# Altium project New_Action.PrjPcb
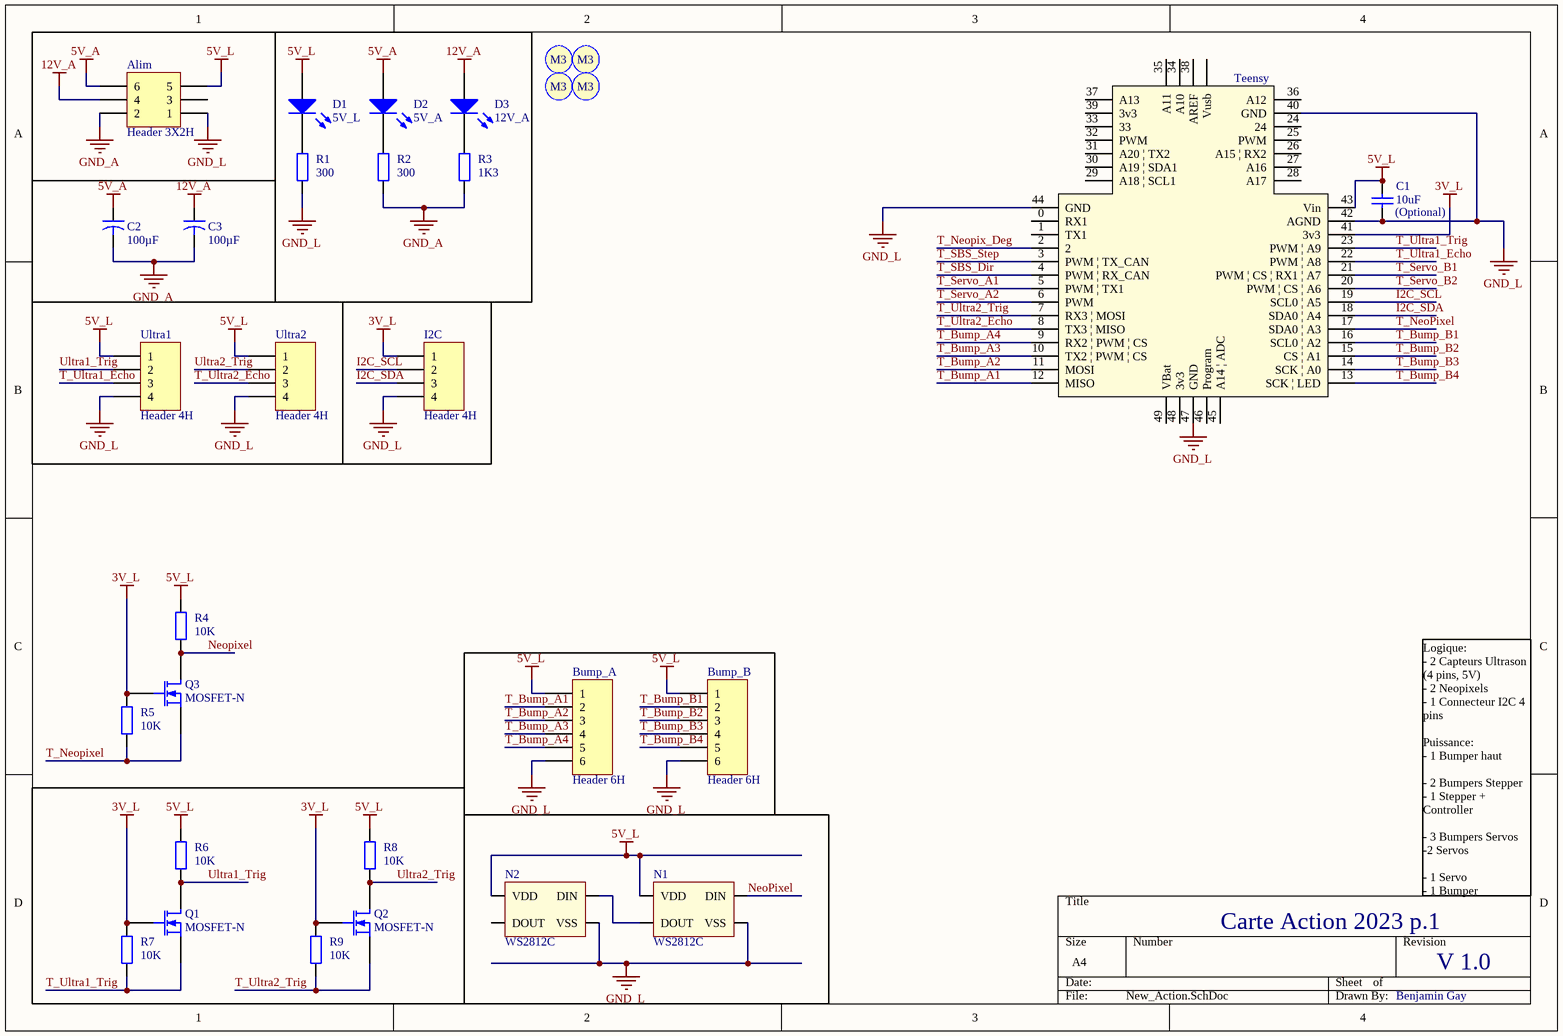
[diagram p0: New_Action.SchDoc]
2 sheets, 57 parts. Net scope: global (net labels, ports and power ports of the same name join across sheets).
Board file: New_Action.PcbDoc
Sheets:
  New_Action.SchDoc
  New_Action_Moteurs.SchDoc

## Sheet New_Action.SchDoc
size A4

### Parts
Alim  Header 3X2H  [MOLEX_MINIFITJR_3X2H]
Bump_A  Header 6H  [S6B-XH-A]
Bump_B  Header 6H  [S6B-XH-A]
C1  (Optional)  value 10uF  [Capacitor 1206]
C2  value 100µF  [Condensateur]  (hidden comment: Cap2)
C3  value 100µF  [Condensateur]  (hidden comment: Cap2)
D1  5V_L  [KP-3216SEC]
D2  5V_A  [KP-3216SEC]
D3  12V_A  [KP-3216SEC]
I2C  Header 4H  [S4B-XH-A]
N1  WS2812C  [WS2812C]
N2  WS2812C  [WS2812C]
Q1  MOSFET-N  [SOT23_M]
Q2  MOSFET-N  [SOT23_M]
Q3  MOSFET-N  [SOT23_M]
R1  value 300  [Resistor 1206]  (hidden comment: Res2)
R2  value 300  [Resistor 1206]  (hidden comment: Res2)
R3  value 1K3  [Resistor 1206]  (hidden comment: Res2)
R4  value 10K  [Resistor 1206]  (hidden comment: Res2)
R5  value 10K  [Resistor 1206]  (hidden comment: Res2)
R6  value 10K  [Resistor 1206]  (hidden comment: Res2)
R7  value 10K  [Resistor 1206]  (hidden comment: Res2)
R8  value 10K  [Resistor 1206]  (hidden comment: Res2)
R9  value 10K  [Resistor 1206]  (hidden comment: Res2)
S1  Screw M3  [Screw M3]  (value not drawn)
S2  Screw M3  [Screw M3]  (value not drawn)
S3  Screw M3  [Screw M3]  (value not drawn)
S4  Screw M3  [Screw M3]  (value not drawn)
Teensy  Teensy 3.2  [teensy]  (value not drawn)
Ultra1  Header 4H  [S4B-XH-A]
Ultra2  Header 4H  [S4B-XH-A]

### Nets
3V_L: I2C.1 Q1.2(G) Q2.2(G) Q3.2(G) R5.1 R7.1 R9.1 Teensy.41(3v3)
5V_A: Alim.6 C2.1 D2.1(A)
5V_L: Alim.5 Bump_A.1 Bump_B.1 C1.2 D1.1(A) N1.1(VDD) N2.1(VDD) R4.1 R6.1 R8.1 Teensy.43(Vin) Ultra1.1 Ultra2.1
12V_A: Alim.4 C3.1 D3.1(A)
GND_A: Alim.2 C2.2 C3.2 R2.2 R3.2
GND_L: Alim.1 Bump_A.6 Bump_B.6 C1.1 I2C.4 N1.3(VSS) N2.3(VSS) R1.1 Teensy.40(GND) Teensy.42(AGND) Teensy.44(GND) Teensy.47(GND) Ultra1.4 Ultra2.4
I2C_SCL: I2C.2 Teensy.19(SCL0_|_A5)
I2C_SDA: I2C.3 Teensy.18(SDA0_|_A4)
NeoPixel: N1.4(DIN) Q3.1(D) R4.2
T_Bump_A1: Bump_A.2 Teensy.12(MISO)
T_Bump_A2: Bump_A.3 Teensy.11(MOSI)
T_Bump_A3: Bump_A.4 Teensy.10(TX2_|_PWM_|_CS)
T_Bump_A4: Bump_A.5 Teensy.9(RX2_|_PWM_|_CS)
T_Bump_B1: Bump_B.2 Teensy.16(SCL0_|_A2)
T_Bump_B2: Bump_B.3 Teensy.15(CS_|_A1)
T_Bump_B3: Bump_B.4 Teensy.14(SCK_|_A0)
T_Bump_B4: Bump_B.5 Teensy.13(SCK_|_LED)
T_Neopix_Deg: Teensy.2
T_NeoPixel: Q3.3(S) R5.2 Teensy.17(SDA0_|_A3)
T_SBS_Dir: Teensy.4(PWM_|_RX_CAN)
T_SBS_Step: Teensy.3(PWM_|_TX_CAN)
T_Servo_A1: Teensy.5(PWM_|_TX1)
T_Servo_A2: Teensy.6(PWM)
T_Servo_B1: Teensy.21(PWM_|_CS_|_RX1_|_A7)
T_Servo_B2: Teensy.20(PWM_|_CS_|_A6)
T_Ultra1_Echo: Teensy.22(PWM_|_A8) Ultra1.3
T_Ultra1_Trig: Q1.3(S) R7.2 Teensy.23(PWM_|_A9)
T_Ultra2_Echo: Teensy.8(TX3_|_MISO) Ultra2.3
T_Ultra2_Trig: Q2.3(S) R9.2 Teensy.7(RX3_|_MOSI)
Ultra1_Trig: Q1.1(D) R6.2 Ultra1.2
Ultra2_Trig: Q2.1(D) R8.2 Ultra2.2
NetD1_2: D1.2(K) R1.2
NetD2_2: D2.2(K) R2.1
NetD3_2: D3.2(K) R3.1
NetN1_2: N1.2(DOUT) N2.4(DIN)

Not connected (* = marked no-connect by the designer): Alim 3; N2 2(DOUT); Teensy 0(RX1) 1(TX1) 24 25(PWM) 26(A15_|_RX2) 27(A16) 28(A17) 29(A18_|_SCL1) 30(A19_|_SDA1) 31(A20_|_TX2) 32(PWM) 33 34(A10) 35(A11) 36(A12) 37(A13) 38(AREF) 39(3v3) 45(A14_|_ADC) 46(Program) 48(3v3) 49(VBat) 50(Vusb)

### Notes on the sheet
- Logique:
  - 2 Capteurs Ultrason (4 pins, 5V)
  - 2 Neopixels
  - 1 Connecteur I2C 4 pins
  Puissance:
  - 1 Bumper haut
  - 2 Bumpers Stepper
  - 1 Stepper + Controller
  - 3 Bumpers Servos
  -2 Servos
  - 1 Servo
  - 1 Bumper
- Carte Action 2023 p.1
- V 1.0
- Benjamin Gay
- (in symbol Screw M3) M3

### Library data of the parts
Alim = Header 3X2H: Header, 3-Pin, Dual row, Right Angle; LatestRevisionDate: 17-Jul-2002; LatestRevisionNote: Re-released for DXP Platform.; Publisher: Altium Limited
Bump_A Bump_B = Header 6H: Header, 6-Pin, Right Angle; LatestRevisionDate: 17-Jul-2002; LatestRevisionNote: Re-released for DXP Platform.; Publisher: Altium Limited
C1 = Cap: Capacitor; Published: 8-Jun-2000; LatestRevisionDate: 17-Jul-2002; LatestRevisionNote: Re-released for DXP Platform.; PackageReference: RAD-0.3; Publisher: Altium Limited; PackageDescription: Radial Cap, Thru-Hole; 2 Leads; 0.3 in Pin Spacing
C2 C3 = Cap2: Capacitor; Published: 23-Sep-2002; PackageReference: CAPR5-4X5; Publisher: Altium Limited; PackageDescription: Capacitor; 2 Leads
D1-D3 = LED2: Typical RED, GREEN, YELLOW, AMBER GaAs LED; Published: 8-Jun-2000; LatestRevisionDate: 17-Jul-2002; LatestRevisionNote: Re-released for DXP Platform.; PackageVersion: Feb-2002; PackageReference: 3.2X1.6X1.1; Publisher: Altium Limited; PackageDescription: SM LED; 2 Flat Leads
I2C Ultra1 Ultra2 = Header 4H: Header, 4-Pin, Right Angle; LatestRevisionDate: 17-Jul-2002; LatestRevisionNote: Re-released for DXP Platform.; Publisher: Altium Limited
N1 N2 = WS2812C: Intelligent control LED
Q1-Q3 = MOSFET-N: N-Channel MOSFET; pin to pad: 2>3 3>2; Published: 8-Jun-2000; LatestRevisionDate: 17-Jul-2002; LatestRevisionNote: Re-released for DXP Platform.; PackageVersion: 1995/1996; PackageReference: E3; Publisher: Altium Limited; PackageDescription: TO, Flat Index; 3 In-Line, Axial Leads; Body Dia. 4.6mm; Lead Dia. 0.5 mm (max)
R1-R9 = Res2: Resistor; Published: 8-Jun-2000; LatestRevisionDate: 17-Jul-2002; LatestRevisionNote: Re-released for DXP Platform.; PackageReference: AXIAL-0.4; Publisher: Altium Limited; PackageDescription: Axial Device, Thru-Hole; 2 Leads; 0.4 in Pin Spacing
Teensy = teensy3.2

## Sheet New_Action_Moteurs.SchDoc
size A4
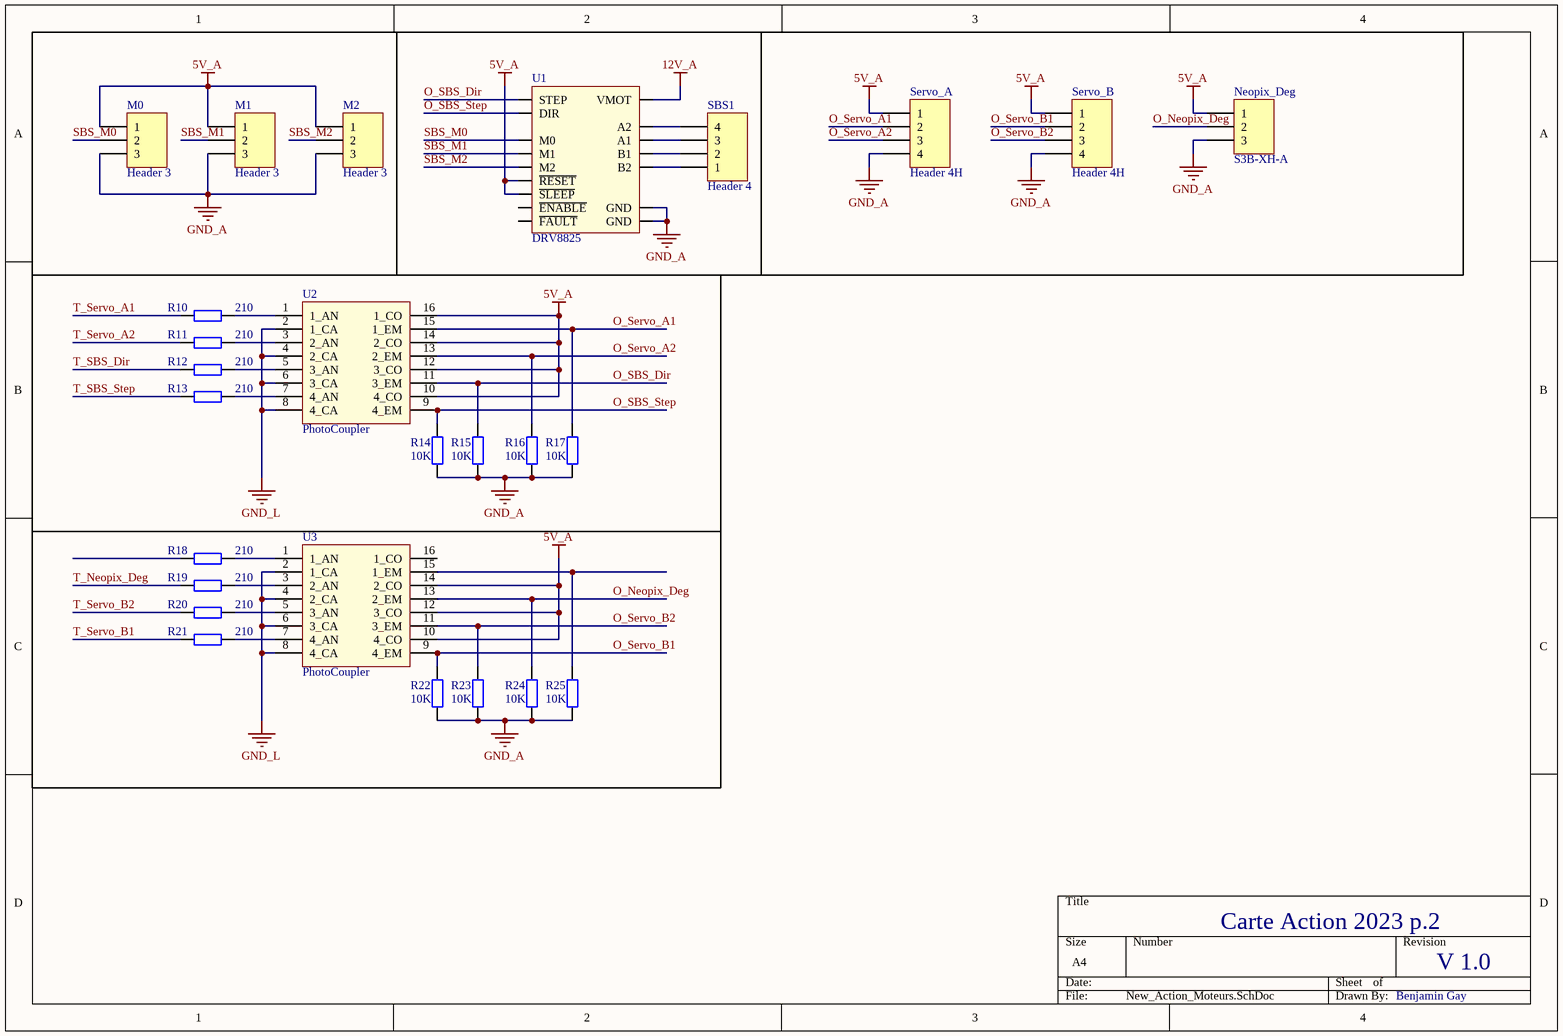
[diagram p1: New_Action_Moteurs.SchDoc]

### Parts
M0  Header 3  [HDR1X3]
M1  Header 3  [HDR1X3]
M2  Header 3  [HDR1X3]
Neopix_Deg  S3B-XH-A  [S3B-XH-A]
R10  value 210  [Resistor 1206]  (hidden comment: Res2)
R11  value 210  [Resistor 1206]  (hidden comment: Res2)
R12  value 210  [Resistor 1206]  (hidden comment: Res2)
R13  value 210  [Resistor 1206]  (hidden comment: Res2)
R14  value 10K  [Resistor 1206]  (hidden comment: Res2)
R15  value 10K  [Resistor 1206]  (hidden comment: Res2)
R16  value 10K  [Resistor 1206]  (hidden comment: Res2)
R17  value 10K  [Resistor 1206]  (hidden comment: Res2)
R18  value 210  [Resistor 1206]  (hidden comment: Res2)
R19  value 210  [Resistor 1206]  (hidden comment: Res2)
R20  value 210  [Resistor 1206]  (hidden comment: Res2)
R21  value 210  [Resistor 1206]  (hidden comment: Res2)
R22  value 10K  [Resistor 1206]  (hidden comment: Res2)
R23  value 10K  [Resistor 1206]  (hidden comment: Res2)
R24  value 10K  [Resistor 1206]  (hidden comment: Res2)
R25  value 10K  [Resistor 1206]  (hidden comment: Res2)
SBS1  Header 4  [S4B-XH-A]
Servo_A  Header 4H  [S4B-XH-A]
Servo_B  Header 4H  [S4B-XH-A]
U1  DRV8825  [DRV8825]
U2  PhotoCoupler  [16 pins SOIC, TI]
U3  PhotoCoupler  [16 pins SOIC, TI]

### Nets
5V_A: M0.1 M1.1 M2.1 Neopix_Deg.1 Servo_A.1 Servo_B.1 U1.5(~{RESET}) U1.6(~{SLEEP}) U2.10(4_CO) U2.12(3_CO) U2.14(2_CO) U2.16(1_CO) U3.10(4_CO) U3.12(3_CO) U3.14(2_CO)
12V_A: U1.16(VMOT)
GND_A: M0.3 M1.3 M2.3 Neopix_Deg.3 R14.1 R15.1 R16.1 R17.1 R22.1 R23.1 R24.1 R25.1 Servo_A.4 Servo_B.4 U1.9(GND) U1.15(GND)
GND_L: U2.2(1_CA) U2.4(2_CA) U2.6(3_CA) U2.8(4_CA) U3.2(1_CA) U3.4(2_CA) U3.6(3_CA) U3.8(4_CA)
O_Neopix_Deg: Neopix_Deg.2 R24.2 U3.13(2_EM)
O_SBS_Dir: R15.2 U1.7(STEP) U2.11(3_EM)
O_SBS_Step: R14.2 U1.8(DIR) U2.9(4_EM)
O_Servo_A1: R17.2 Servo_A.2 U2.15(1_EM)
O_Servo_A2: R16.2 Servo_A.3 U2.13(2_EM)
O_Servo_B1: R22.2 Servo_B.2 U3.9(4_EM)
O_Servo_B2: R23.2 Servo_B.3 U3.11(3_EM)
SBS_M0: M0.2 U1.2(M0)
SBS_M1: M1.2 U1.3(M1)
SBS_M2: M2.2 U1.4(M2)
T_Neopix_Deg: R19.2
T_SBS_Dir: R12.2
T_SBS_Step: R13.2
T_Servo_A1: R10.2
T_Servo_A2: R11.2
T_Servo_B1: R21.2
T_Servo_B2: R20.2
NetR10_1: R10.1 U2.1(1_AN)
NetR11_1: R11.1 U2.3(2_AN)
NetR12_1: R12.1 U2.5(3_AN)
NetR13_1: R13.1 U2.7(4_AN)
NetR18_1: R18.1 U3.1(1_AN)
NetR19_1: R19.1 U3.3(2_AN)
NetR20_1: R20.1 U3.5(3_AN)
NetR21_1: R21.1 U3.7(4_AN)
NetR25_2: R25.2 U3.15(1_EM)
NetSBS1_1: SBS1.1 U1.14(B2)
NetSBS1_2: SBS1.2 U1.13(B1)
NetSBS1_3: SBS1.3 U1.12(A1)
NetSBS1_4: SBS1.4 U1.11(A2)

Not connected (* = marked no-connect by the designer): R18 2; U1 1(~{ENABLE}) 10(~{FAULT}); U3 16(1_CO)

### Notes on the sheet
- Carte Action 2023 p.2
- V 1.0
- Benjamin Gay

### Library data of the parts
M0-M2 = Header 3: Header, 3-Pin; LatestRevisionDate: 17-Jul-2002; LatestRevisionNote: Re-released for DXP Platform.; Publisher: Altium Limited
Neopix_Deg = Header 3H: Header, 3-Pin, Right Angle; LatestRevisionDate: 17-Jul-2002; LatestRevisionNote: Re-released for DXP Platform.; Publisher: Altium Limited
R10-R25 = Res2: Resistor; Published: 8-Jun-2000; LatestRevisionDate: 17-Jul-2002; LatestRevisionNote: Re-released for DXP Platform.; PackageReference: AXIAL-0.4; Publisher: Altium Limited; PackageDescription: Axial Device, Thru-Hole; 2 Leads; 0.4 in Pin Spacing
SBS1 = Header 4: Header, 4-Pin; LatestRevisionDate: 17-Jul-2002; LatestRevisionNote: Re-released for DXP Platform.; Publisher: Altium Limited
Servo_A Servo_B = Header 4H: Header, 4-Pin, Right Angle; LatestRevisionDate: 17-Jul-2002; LatestRevisionNote: Re-released for DXP Platform.; Publisher: Altium Limited
U1 = DRV8825: Stepper Driver Module
U2 U3 = LTV-247: Integrated Circuit; Manufacturer_Name: Lite-On; Datasheet Link: http://optoelectronics.liteon.com/upload/download/DS70-2009-0014/LTV-2X7%20sereis%20Mar17.PDF; Manufacturer_Part_Number: LTV-247; Mouser Part Number: 859-LTV-247; Mouser Price/Stock: https://www.mouser.co.uk/ProductDetail/Lite-On/LTV-247/?qs=9ayhpukWNmvWpoxQBzWkFA%3D%3D; Arrow Part Number: LTV-247; Arrow Price/Stock: https://www.arrow.com/en/products/ltv-247/lite-on-technology

## Nets that join several sheets
5V_A: New_Action (Alim.6 C2.1 D2.1), New_Action_Moteurs (15 pins)
12V_A: New_Action (Alim.4 C3.1 D3.1), New_Action_Moteurs (U1.16)
GND_A: New_Action (5 pins), New_Action_Moteurs (16 pins)
GND_L: New_Action (14 pins), New_Action_Moteurs (8 pins)
T_Neopix_Deg: New_Action (Teensy.2), New_Action_Moteurs (R19.2)
T_SBS_Dir: New_Action (Teensy.4), New_Action_Moteurs (R12.2)
T_SBS_Step: New_Action (Teensy.3), New_Action_Moteurs (R13.2)
T_Servo_A1: New_Action (Teensy.5), New_Action_Moteurs (R10.2)
T_Servo_A2: New_Action (Teensy.6), New_Action_Moteurs (R11.2)
T_Servo_B1: New_Action (Teensy.21), New_Action_Moteurs (R21.2)
T_Servo_B2: New_Action (Teensy.20), New_Action_Moteurs (R20.2)